# EAGLE design dpdt_switch_breakout (EAGLE 9.6.0)
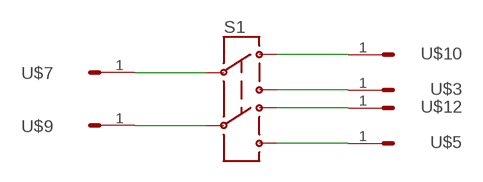
[diagram p0: schematic, sheet 1]

## Parts
S1  SWITCH-DPDTPTH1  [SWITCH-DPDT_SUBMINIATURE]
U$3  HEADER/MALE/01NOBORDER  [HEADER/MALE/01/NOBORDER]
U$5  HEADER/MALE/01NOBORDER  [HEADER/MALE/01/NOBORDER]
U$7  HEADER/MALE/01NOBORDER  [HEADER/MALE/01/NOBORDER]
U$9  HEADER/MALE/01NOBORDER  [HEADER/MALE/01/NOBORDER]
U$10  HEADER/MALE/01NOBORDER  [HEADER/MALE/01/NOBORDER]
U$12  HEADER/MALE/01NOBORDER  [HEADER/MALE/01/NOBORDER]

## Nets
N$1: S1.6 U$5.1
N$2: S1.1 U$10.1
N$3: S1.3 U$3.1
N$4: S1.2 U$7.1
N$6: S1.4 U$12.1
N$7: S1.5 U$9.1

## Library data of the parts
S1 = electromechanical:SWITCH-DPDT: DPDT Version of the COM-00597
U$3 U$5 U$7 U$9 U$10 U$12 = connectors:HEADER/MALE/01

## Board
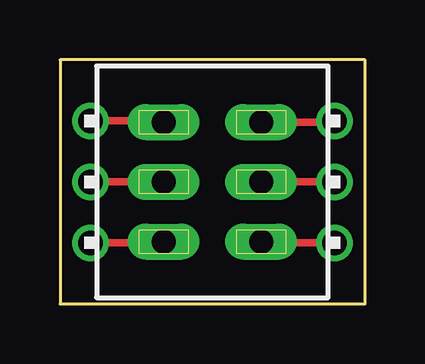
[diagram p1: board, top side]

Size 12.7 x 10.16 mm. Coordinates in mm from the lower left corner, seen from the top.
Outline: 12.7,10.16 0,10.16 0,0 12.7,0 12.7,10.16
Copper layers (1*16): Top 0.0356mm / dielectric 1.5011mm / Bottom 0.0356mm
Design rules "oshpark": minimum track width 6mil, minimum drill 13mil, track to track 6mil, track to pad 6mil, pad to pad 6mil, via to via 6mil, smd to smd 6mil, copper to edge 15mil, drill to drill 6mil, minimum pad ring 7mil, minimum via ring 7mil, stop-mask expansion 4mil, vias tented up to drill 0mil, thermal gap 10mil

### Footprints (pad centres in the part's own frame; a part is rotated, then mirrored left to right if it is on the bottom)
SWITCH-DPDT_SUBMINIATURE = drill 1 pad 1.422 long: 1 -2.032,-2.489; 2 -2.032,0; 3 -2.032,2.489; 4 2.032,-2.489; 5 2.032,0; 6 2.032,2.489
HEADER/MALE/01/NOBORDER = drill 1.016: 1 0,0

### Placement (x,y rotation side)
S1  6.35,5.08 0 top
U$3  1.27,7.62 0 top
U$5  11.43,7.62 0 top
U$7  1.27,5.08 0 top
U$9  11.43,5.08 0 top
U$10  1.27,2.54 0 top
U$12  11.43,2.54 0 top

### Tracks (layer width: path | path; a pad name or v marks a point on that pad's centre or on a via)
N$1
  Top 0.305: S1.6 11.38,7.57 U$5.1
N$2
  Top 0.305: U$10.1 4.27,2.54 S1.1
N$3
  Top 0.305: U$3.1 4.27,7.62 S1.3
N$4
  Top 0.305: U$7.1 S1.2
N$6
  Top 0.305: U$12.1 8.43,2.54 S1.4
N$7
  Top 0.305: U$9.1 S1.5